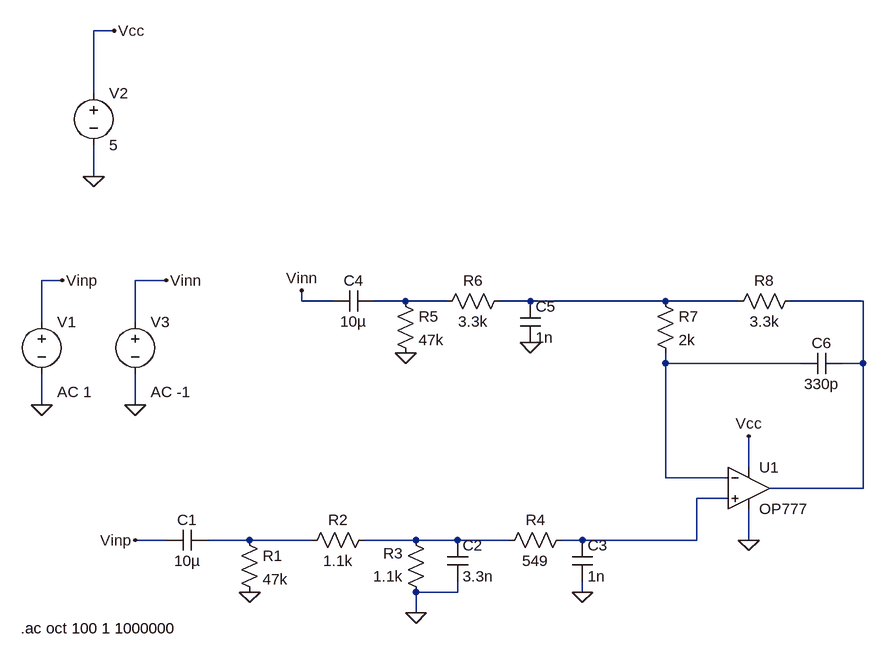
[diagram p0: schematic codec_out_filter.asc]
codec_out_filter.asc, the LTspice schematic file:
Version 4
SHEET 1 1096 680
WIRE -64 -496 -96 -496
WIRE -96 -400 -96 -496
WIRE -96 -272 -96 -320
WIRE -144 -112 -176 -112
WIRE 16 -112 -32 -112
WIRE 224 -80 224 -96
WIRE 272 -80 224 -80
WIRE 384 -80 336 -80
WIRE 448 -80 384 -80
WIRE 576 -80 528 -80
WIRE 784 -80 576 -80
WIRE 896 -80 784 -80
WIRE 1088 -80 976 -80
WIRE -176 -48 -176 -112
WIRE -32 -48 -32 -112
WIRE 784 16 784 0
WIRE 992 16 784 16
WIRE 1088 16 1088 -80
WIRE 1088 16 1056 16
WIRE -176 80 -176 32
WIRE -32 80 -32 32
WIRE 912 176 912 128
WIRE 784 192 784 16
WIRE 880 192 784 192
WIRE 1088 208 1088 16
WIRE 1088 208 944 208
WIRE 880 224 832 224
WIRE 16 288 -32 288
WIRE 144 288 80 288
WIRE 240 288 144 288
WIRE 400 288 320 288
WIRE 464 288 400 288
WIRE 544 288 464 288
WIRE 656 288 624 288
WIRE 832 288 832 224
WIRE 832 288 656 288
WIRE 912 288 912 240
WIRE 464 368 464 352
WIRE 464 368 400 368
WIRE 656 368 656 352
WIRE 400 400 400 368
FLAG 144 368 0
FLAG 400 400 0
FLAG 656 368 0
FLAG -176 80 0
FLAG -144 -112 Vinp
FLAG -32 288 Vinp
FLAG 384 0 0
FLAG 576 -16 0
FLAG 224 -96 Vinn
FLAG -96 -272 0
FLAG -64 -496 Vcc
FLAG 912 128 Vcc
FLAG 912 288 0
FLAG -32 80 0
FLAG 16 -112 Vinn
SYMBOL cap 80 272 R90
WINDOW 0 0 32 VBottom 2
WINDOW 3 32 32 VTop 2
SYMATTR InstName C1
SYMATTR Value 10µ
SYMBOL res 128 272 R0
SYMATTR InstName R1
SYMATTR Value 47k
SYMBOL res 336 272 R90
WINDOW 0 0 56 VBottom 2
WINDOW 3 32 56 VTop 2
SYMATTR InstName R2
SYMATTR Value 1.1k
SYMBOL res 416 384 R180
WINDOW 0 36 76 Left 2
WINDOW 3 36 40 Left 2
SYMATTR InstName R3
SYMATTR Value 1.1k
SYMBOL cap 448 288 R0
SYMATTR InstName C2
SYMATTR Value 3.3n
SYMBOL res 640 272 R90
WINDOW 0 0 56 VBottom 2
WINDOW 3 32 56 VTop 2
SYMATTR InstName R4
SYMATTR Value 549
SYMBOL cap 640 288 R0
SYMATTR InstName C3
SYMATTR Value 1n
SYMBOL cap 336 -96 R90
WINDOW 0 0 32 VBottom 2
WINDOW 3 32 32 VTop 2
SYMATTR InstName C4
SYMATTR Value 10µ
SYMBOL res 368 -96 R0
SYMATTR InstName R5
SYMATTR Value 47k
SYMBOL res 544 -96 R90
WINDOW 0 0 56 VBottom 2
WINDOW 3 32 56 VTop 2
SYMATTR InstName R6
SYMATTR Value 3.3k
SYMBOL cap 560 -80 R0
SYMATTR InstName C5
SYMATTR Value 1n
SYMBOL res 768 -96 R0
SYMATTR InstName R7
SYMATTR Value 2k
SYMBOL res 992 -96 R90
WINDOW 0 0 56 VBottom 2
WINDOW 3 32 56 VTop 2
SYMATTR InstName R8
SYMATTR Value 3.3k
SYMBOL cap 1056 0 R90
WINDOW 0 0 32 VBottom 2
WINDOW 3 32 32 VTop 2
SYMATTR InstName C6
SYMATTR Value 330p
SYMBOL voltage -176 -64 R0
WINDOW 123 24 124 Left 2
WINDOW 39 0 0 Left 0
SYMATTR InstName V1
SYMATTR Value ""
SYMATTR Value2 AC 1
SYMBOL OpAmps\\OP777 912 144 R0
SYMATTR InstName U1
SYMBOL voltage -96 -416 R0
WINDOW 123 0 0 Left 0
WINDOW 39 0 0 Left 0
SYMATTR InstName V2
SYMATTR Value 5
SYMBOL voltage -32 -64 R0
WINDOW 123 24 124 Left 2
WINDOW 39 0 0 Left 0
SYMATTR InstName V3
SYMATTR Value ""
SYMATTR Value2 AC -1
TEXT -208 424 Left 2 !.ac oct 100 1 1000000

The netlist it stands for:
* codec_out_filter.asc
C1 N006 Vinp 10µ
R1 N006 0 47k
R2 N007 N006 1.1k
R3 0 N007 1.1k
C2 N007 0 3.3n
R4 N005 N007 549
C3 N005 0 1n
C4 N001 Vinn 10µ
R5 N001 0 47k
R6 N002 N001 3.3k
C5 N002 0 1n
R7 N002 N004 2k
R8 N003 N002 3.3k
C6 N003 N004 330p
V1 Vinp 0 AC 1
XU1 N005 N004 Vcc 0 N003 OP777  ; pins In+ In- V+ V- OUT
V2 Vcc 0 5
V3 Vinn 0 AC -1
.ac oct 100 1 1000000
.lib ADI.lib
.backanno
.end